# EAGLE design tick-mk-4.1 (EAGLE 6.5.0)
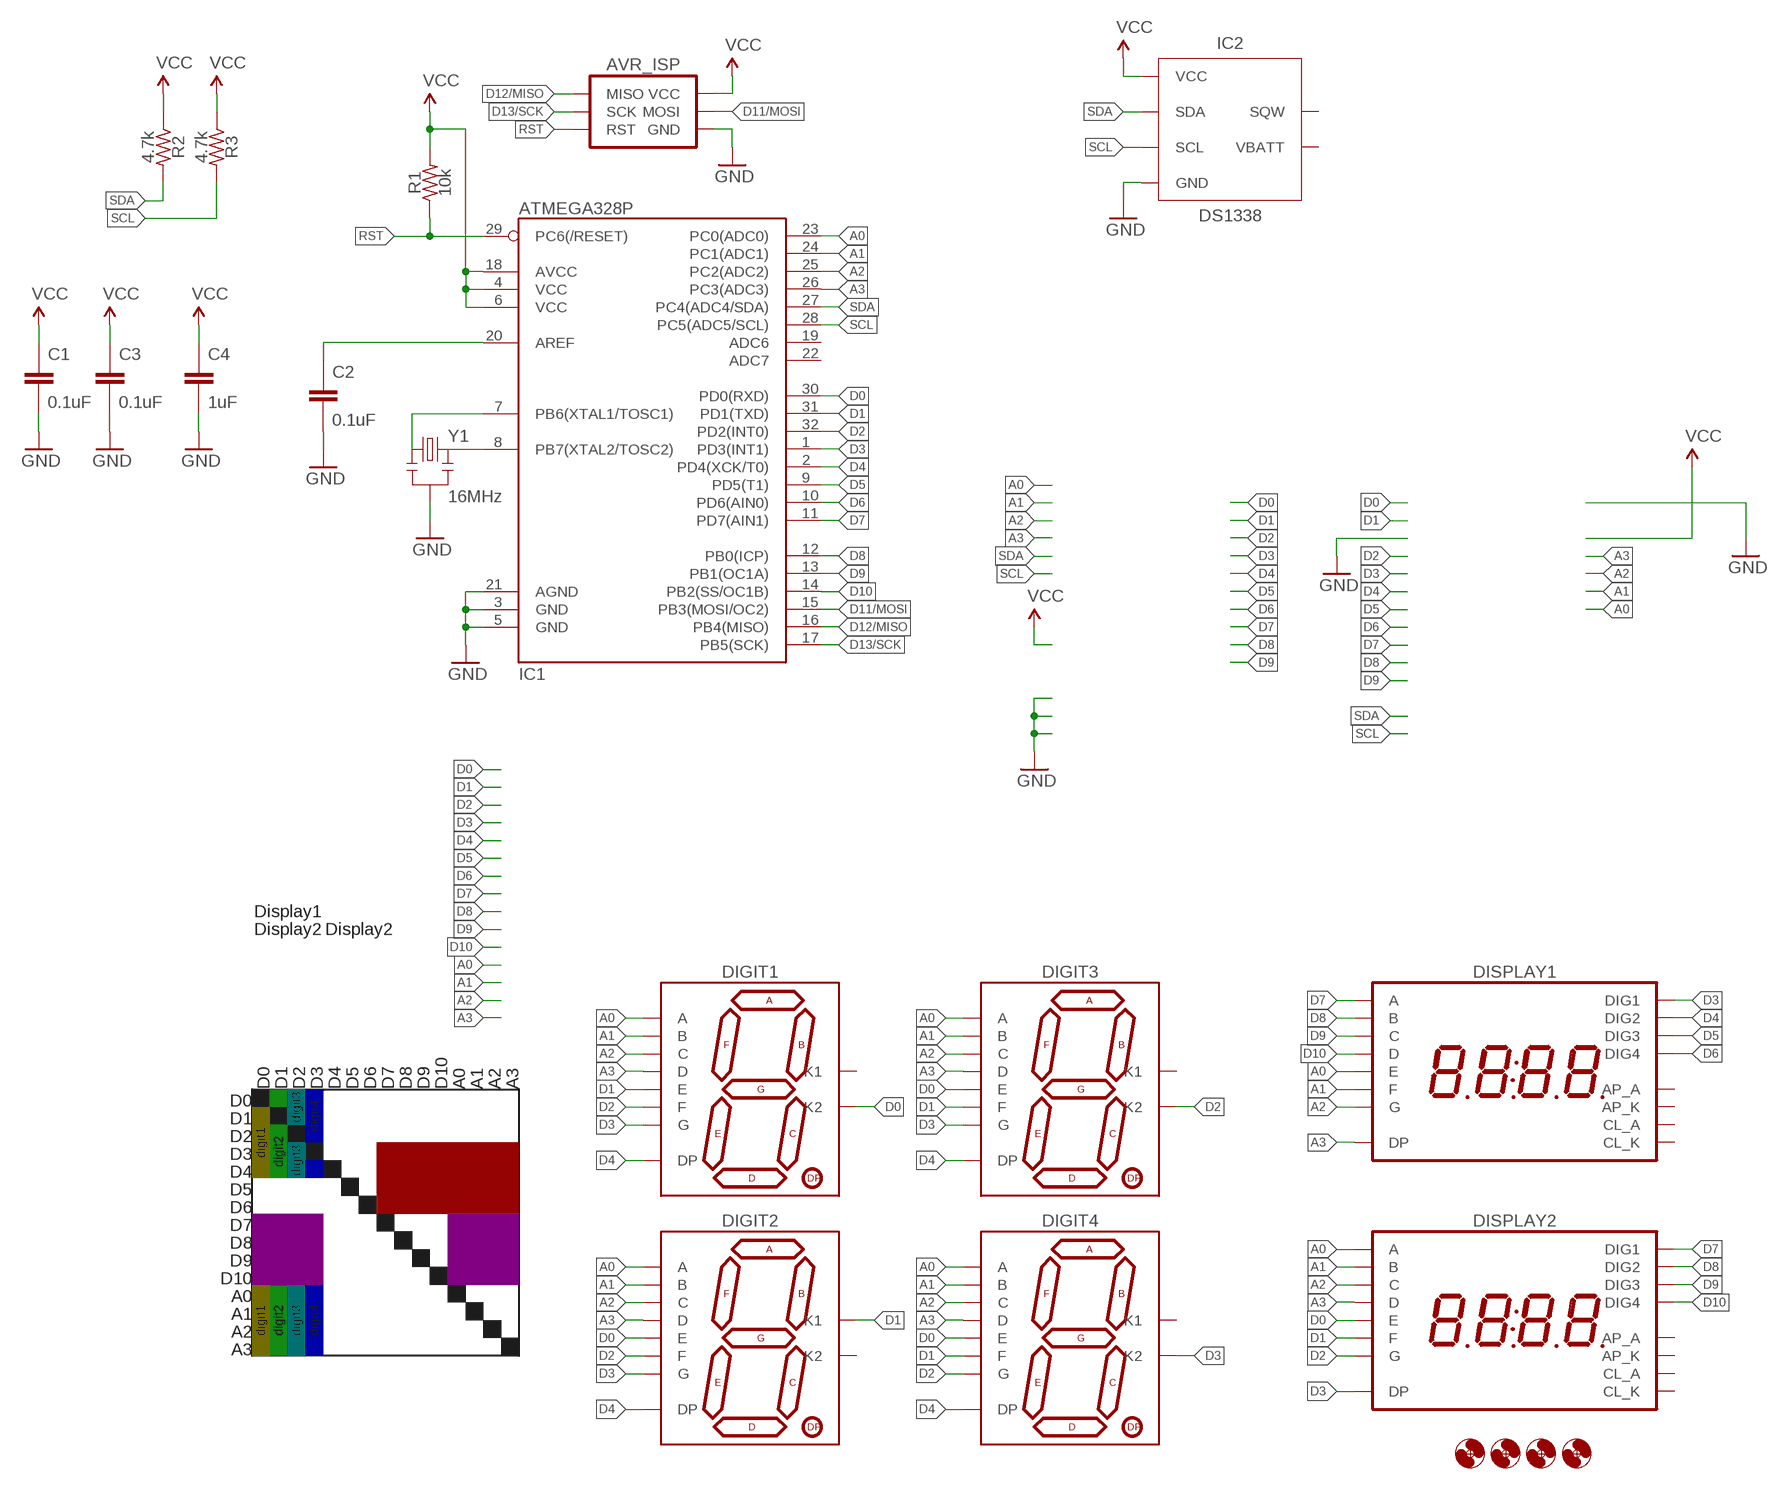
[diagram p0: schematic, sheet 1]

## Parts
AVR_ISP  AVR_SPI_PRG_6PTH  [2X3]
C1  0.1uF  CAPACITOR-CERAMICC0805  [C0805]
C2  0.1uF  CAPACITOR-CERAMICC0805  [C0805]
C3  0.1uF  CAPACITOR-CERAMICC0805  [C0805]
C4  1uF  CAPACITOR-CERAMICC0805  [C0805]
DIGIT1  7SEG_1DIGPTH-25.4MM  [7SEG_1DIG_25.4MM]
DIGIT2  7SEG_1DIGPTH-25.4MM  [7SEG_1DIG_25.4MM]
DIGIT3  7SEG_1DIGPTH-25.4MM  [7SEG_1DIG_25.4MM]
DIGIT4  7SEG_1DIGPTH-25.4MM  [7SEG_1DIG_25.4MM]
DISPLAY1  7SEG_4DIGIT_COLON_APOS  [7SEG_4DIG_10MM]
DISPLAY2  7SEG_4DIGIT_COLON_APOS  [7SEG_4DIG_10MM]
H1  HOLE#2  [HOLE-#2]
H2  HOLE#2  [HOLE-#2]
H3  HOLE#2  [HOLE-#2]
H4  HOLE#2  [HOLE-#2]
IC1  ATMEGA328P  ATMEGA328_SMT  [TQFP32-08]
IC2  DS1338  DS1338CSOIC16W  [SO16W]
R1  10k  RESISTORR0805  [R0805]
R2  4.7k  RESISTORR0805  [R0805]
R3  4.7k  RESISTORR0805  [R0805]
Y1  16MHz  RESONATORSMD-4.7X4.1X1.2  [RESONATOR-4.7X4.1X1.2MM]

## Nets
A0: DIGIT1.7(A) DIGIT2.7(A) DIGIT3.7(A) DIGIT4.7(A) DISPLAY1.5(E) DISPLAY2.14(A) IC1.23(PC0(ADC0))
A1: DIGIT1.6(B) DIGIT2.6(B) DIGIT3.6(B) DIGIT4.6(B) DISPLAY1.11(F) DISPLAY2.16(B) IC1.24(PC1(ADC1))
A2: DIGIT1.4(C) DIGIT2.4(C) DIGIT3.4(C) DIGIT4.4(C) DISPLAY1.15(G) DISPLAY2.13(C) IC1.25(PC2(ADC2))
A3: DIGIT1.2(D) DIGIT2.2(D) DIGIT3.2(D) DIGIT4.2(D) DISPLAY1.7(DP) DISPLAY2.3(D) IC1.26(PC3(ADC3))
D0: DIGIT1.8(K2) DIGIT2.1(E) DIGIT3.1(E) DIGIT4.1(E) DISPLAY2.5(E) IC1.30(PD0(RXD))
D1: DIGIT1.1(E) DIGIT2.3(K1) DIGIT3.9(F) DIGIT4.9(F) DISPLAY2.11(F) IC1.31(PD1(TXD))
D2: DIGIT1.9(F) DIGIT2.9(F) DIGIT3.8(K2) DIGIT4.10(G) DISPLAY2.15(G) IC1.32(PD2(INT0))
D3: DIGIT1.10(G) DIGIT2.10(G) DIGIT3.10(G) DIGIT4.8(K2) DISPLAY1.1(DIG1) DISPLAY2.7(DP) IC1.1(PD3(INT1))
D4: DIGIT1.5(DP) DIGIT2.5(DP) DIGIT3.5(DP) DIGIT4.5(DP) DISPLAY1.2(DIG2) IC1.2(PD4(XCK/T0))
D5: DISPLAY1.6(DIG3) IC1.9(PD5(T1))
D6: DISPLAY1.8(DIG4) IC1.10(PD6(AIN0))
D7: DISPLAY1.14(A) DISPLAY2.1(DIG1) IC1.11(PD7(AIN1))
D8: DISPLAY1.16(B) DISPLAY2.2(DIG2) IC1.12(PB0(ICP))
D9: DISPLAY1.13(C) DISPLAY2.6(DIG3) IC1.13(PB1(OC1A))
D10: DISPLAY1.3(D) DISPLAY2.8(DIG4) IC1.14(PB2(SS/OC1B))
D11/MOSI: AVR_ISP.4(MOSI) IC1.15(PB3(MOSI/OC2))
D12/MISO: AVR_ISP.1(MISO) IC1.16(PB4(MISO))
D13/SCK: AVR_ISP.3(SCK) IC1.17(PB5(SCK))
GND: AVR_ISP.6(GND) C1.2 C2.2 C3.2 C4.2 IC1.3(GND) IC1.5(GND) IC1.21(AGND) IC2.4(GND) IC2.5(GND) IC2.6(GND) IC2.7(GND) IC2.8(GND) IC2.9(GND) IC2.10(GND) IC2.11(GND) IC2.12(GND) IC2.13(GND) IC2.15(GND) Y1.2
N$1: C2.1 IC1.20(AREF)
N$2: IC1.7(PB6(XTAL1/TOSC1)) Y1.1
N$3: IC1.8(PB7(XTAL2/TOSC2)) Y1.3
RST: AVR_ISP.5(RST) IC1.29(PC6(/RESET)) R1.1
SCL: IC1.28(PC5(ADC5/SCL)) IC2.1(SCL) R3.2
SDA: IC1.27(PC4(ADC4/SDA)) IC2.16(SDA) R2.2
VCC: AVR_ISP.2(VCC) C1.1 C3.1 C4.1 IC1.4(VCC) IC1.6(VCC) IC1.18(AVCC) IC2.3(VCC) R1.2 R2.1 R3.1
Unconnected: DIGIT1.3(K1) DIGIT2.8(K2) DIGIT3.3(K1) DIGIT4.3(K1) DISPLAY1.4(CL_A) DISPLAY1.9(AP_K) DISPLAY1.10(AP_A) DISPLAY1.12(CL_K) DISPLAY2.4(CL_A) DISPLAY2.9(AP_K) DISPLAY2.10(AP_A) DISPLAY2.12(CL_K) IC1.19(ADC6) IC1.22(ADC7) IC2.2(SQW) IC2.14(VBATT)

## Notes on the sheet
- Display1
- Display2 | Display2
- D0 | D1 | D2 | D3 | D4 | D5 | D6 | D7 | D8 | D9 | D10 | A0 | A1 | A2 | A3
- D0 | digit3
- digit4
- D1
- D2 | digit1
- digit2
- D3 | digit3
- D4
- D5
- D6
- D7
- D8
- D9
- D10
- A0
- A1 | digit1 | digit2 | digit3 | digit4
- A2
- A3

## Library data of the parts
AVR_ISP = A_butts:AVR_SPI_PRG_6: AVR ISP 6 Pin This is the reduced ISP connector for AVR programming. Common on Arduino. This footprint will take up less PCB space and can be used with a 10-pin to 6-pin adapter such as SKU: BOB-08508 **Special note about "TEST_POINT" package. The stop mask is on the top side, so if you want your programming test points to be on the bottom of your board, make sure to place this package on the bottom side of the board. This also ensure that the orientation to program from the bottom side will be correct.
C1-C4 = A_butts:CAPACITOR-CERAMIC: CAPACITOR, European symbol
DIGIT1-DIGIT4 = A_butts:7SEG_1DIG
DISPLAY1 DISPLAY2 = A_butts:7SEG_4DIGIT_COLON_APOS
H1-H4 = A_butts:HOLE: MOUNTING HOLE with drill center marker
IC1 = A_butts:ATMEGA328_SMT: 32-Pin Atmega328 part Commonly used on Arduino compatible boards Available in QFP and QFN packages TQFP is IC-09069 QFN is non-stock; PROD_ID: IC-09069
IC2 = A_butts:DS1338C
R1-R3 = A_butts:RESISTOR: RESISTOR, American symbol
Y1 = A_butts:RESONATOR: Resonator Small SMD resonator. Used, eg, on the Arduino Pro/ Pro Mini boards. 8MHz- XTAL-08895 16MHz- XTAL-08900

## Board
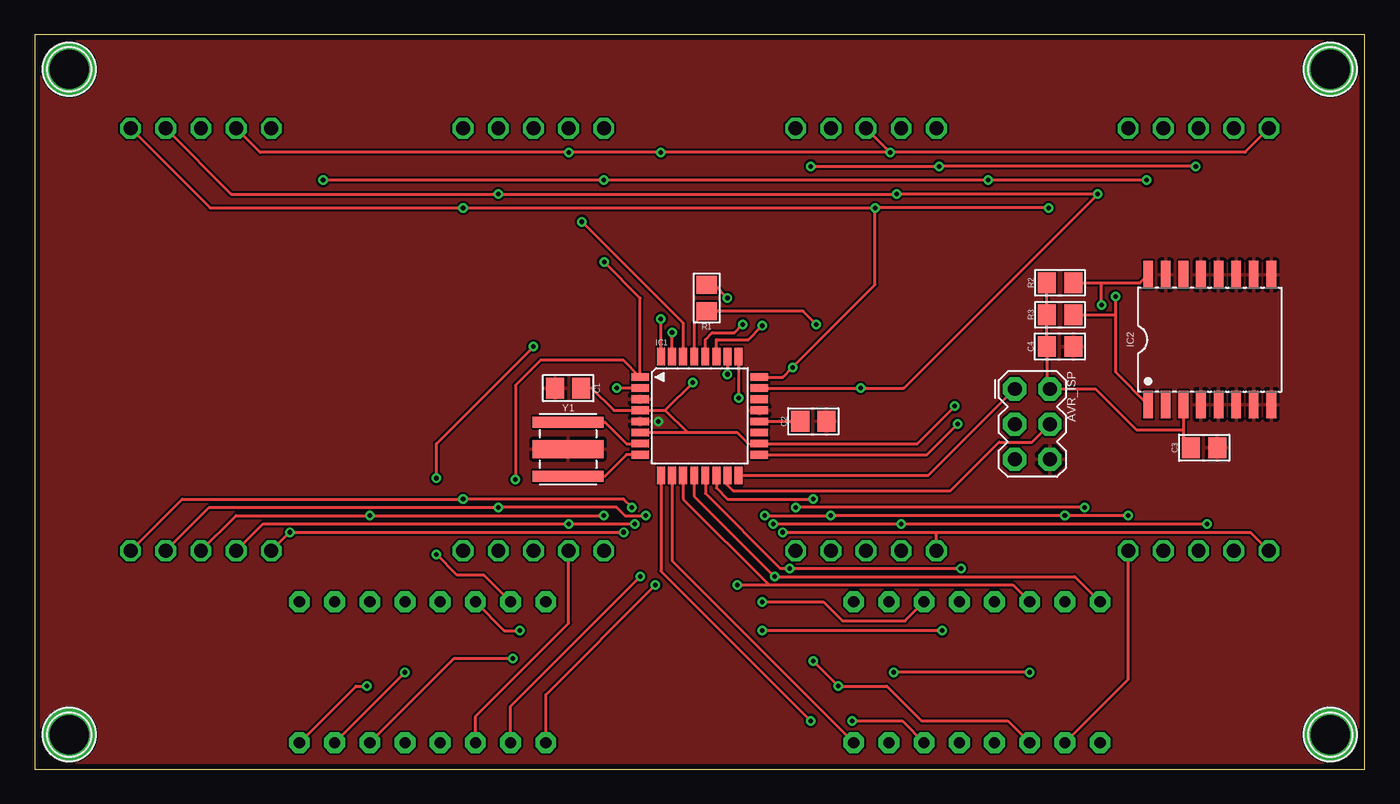
[diagram p1: board, top side]
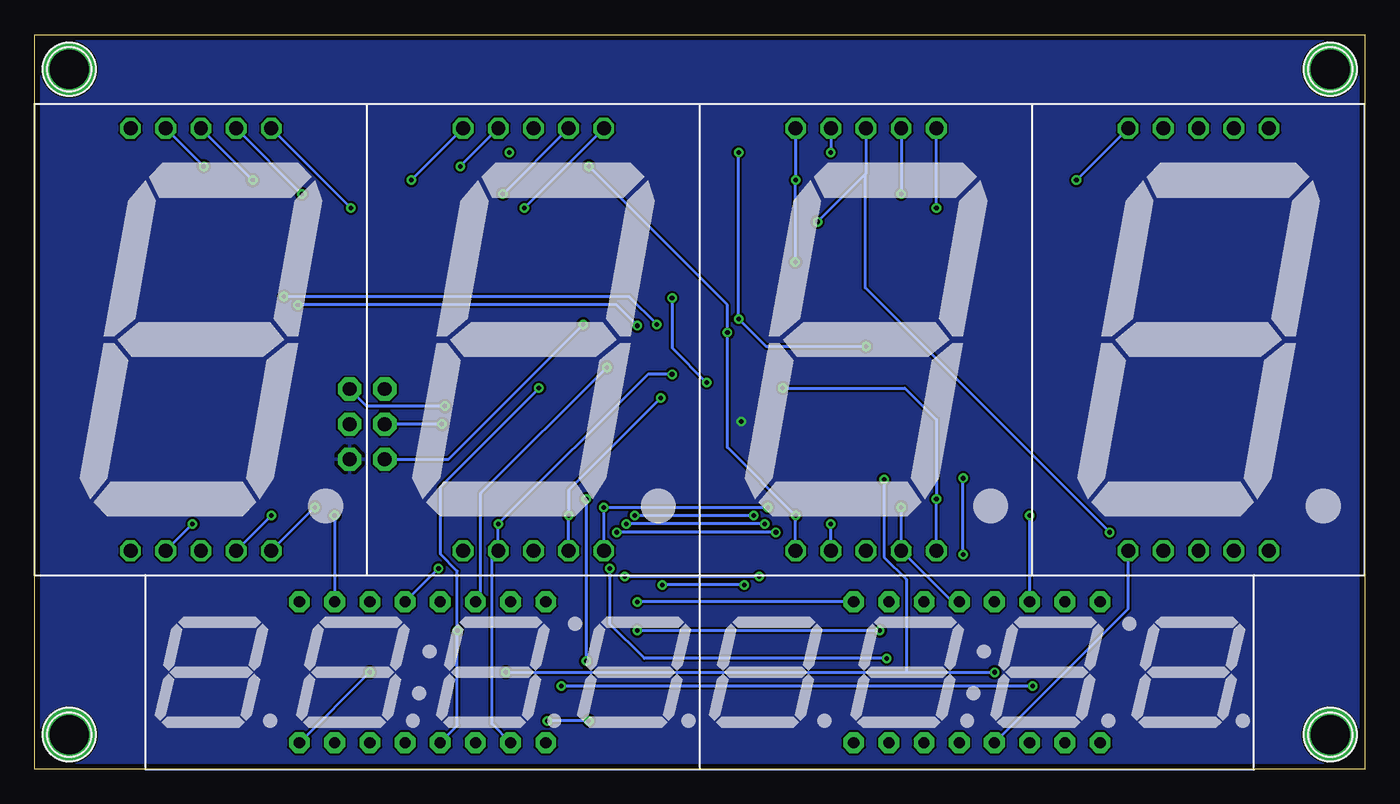
[diagram p2: board, bottom side, seen from below]

Size 96 x 53 mm. Coordinates in mm from the lower left corner, seen from the top.
Outline: 96,0 96,53 0,53 0,0 96,0
Copper layers (1*16): Top 0.0356mm / dielectric 1.5011mm / Bottom 0.0356mm
Design rules "LaenPCBOrder2": minimum track width 6mil, minimum drill 13mil, track to track 6mil, track to pad 6mil, pad to pad 6mil, via to via 6mil, smd to smd 6mil, copper to edge 15mil, drill to drill 6mil, minimum pad ring 7mil, minimum via ring 7mil, stop-mask expansion 3mil, vias tented up to drill 20mil, thermal gap 10mil

### Footprints (pad centres in the part's own frame; a part is rotated, then mirrored left to right if it is on the bottom)
2X3 = drill 1 pad 1.676 octagon: 1 -2.54,-1.27; 2 -2.54,1.27; 3 0,-1.27; 4 0,1.27; 5 2.54,-1.27; 6 2.54,1.27
C0805 = smd 1.3 x 1.5: 1 -0.95,0; 2 0.95,0
7SEG_1DIG_25.4MM = drill 1 pad 1.5 octagon: 1 -5.08,-15.24; 2 -2.54,-15.24; 3 0,-15.24; 4 2.54,-15.24; 5 5.08,-15.24; 6 5.08,15.24; 7 2.54,15.24; 8 0,15.24; 9 -2.54,15.24; 10 -5.08,15.24
7SEG_4DIG_10MM = drill 0.8 pad 1.5 octagon: 1 -8.89,-5.08; 2 -6.35,-5.08; 3 -3.81,-5.08; 4 -1.27,-5.08; 5 1.27,-5.08; 6 3.81,-5.08; 7 6.35,-5.08; 8 8.89,-5.08; 9 8.89,5.08; 10 6.35,5.08; 11 3.81,5.08; 12 1.27,5.08; 13 -1.27,5.08; 14 -3.81,5.08; 15 -6.35,5.08; 16 -8.89,5.08
HOLE-#2 = drill 2.8 pad 3.81: P$1 0,0
TQFP32-08 = smd 1.27 x 0.559: 1 -4.293,2.8; 2 -4.293,2; 3 -4.293,1.2; 4 -4.293,0.4; 5 -4.293,-0.4; 6 -4.293,-1.2; 7 -4.293,-2; 8 -4.293,-2.8; 17 4.293,-2.8; 18 4.293,-2; 19 4.293,-1.2; 20 4.293,-0.4; 21 4.293,0.4; 22 4.293,1.2; 23 4.293,2; 24 4.293,2.8 | smd 0.559 x 1.27: 9 -2.8,-4.293; 10 -2,-4.293; 11 -1.2,-4.293; 12 -0.4,-4.293; 13 0.4,-4.293; 14 1.2,-4.293; 15 2,-4.293; 16 2.8,-4.293; 25 2.8,4.293; 26 2,4.293; 27 1.2,4.293; 28 0.4,4.293; 29 -0.4,4.293; 30 -1.2,4.293; 31 -2,4.293; 32 -2.8,4.293
SO16W = smd 0.7 x 2: 1 -4.445,-4.685; 2 -3.175,-4.685; 3 -1.905,-4.685; 4 -0.635,-4.685; 5 0.635,-4.685; 6 1.905,-4.685; 7 3.175,-4.685; 8 4.445,-4.685; 9 4.445,4.685; 10 3.175,4.685; 11 1.905,4.685; 12 0.635,4.685; 13 -0.635,4.685; 14 -1.905,4.685; 15 -3.175,4.685; 16 -4.445,4.685
R0805 = smd 1.3 x 1.5: 1 -0.95,0; 2 0.95,0
RESONATOR-4.7X4.1X1.2MM = smd 0.8 x 5.1: 1 -1.95,0; 3 1.95,0 | smd 1.3 x 5.1: 2 0,0

### Placement (x,y rotation side)
AVR_ISP  72,24.9 270 top
C1  38.5,27.5 180 top
C2  56.2,25.1 0 top
C3  84.4,23.2 0 top
C4  74,30.5 0 top
DIGIT1  36,31 0 bottom
DIGIT2  12,31 0 bottom
DIGIT3  60,31 0 bottom
DIGIT4  84,31 0 bottom
DISPLAY1  68,7 0 bottom
DISPLAY2  28,7 0 bottom
H1  2.5,2.5 0 top
H2  2.5,50.5 0 top
H3  93.5,2.5 0 top
H4  93.5,50.5 0 top
IC1  48,25.5 0 top
IC2  84.8,31 0 top
R1  48.5,34 90 top
R2  74,35.1 0 top
R3  74,32.8 0 top
Y1  38.5,23.1 270 top

### Tracks (layer width: path | path; a pad name or v marks a point on that pad's centre or on a via)
A0  (via drill 0.33)
  Top 0.2: DIGIT2.7 14.2,41.5 v33.46,41.5 v62.2,41.5 v76.72,41.5 62.72,27.5 v59.6,27.5 IC1.23 | DISPLAY2.14 33.89,10 v35,10 | v65.5,10 v52.5,10
  Bottom 0.2: DIGIT4.7 v76.72,41.5 | v62.2,41.5 DIGIT3.7 | DIGIT1.7 v33.46,41.5 | DISPLAY1.5 65.5,3.15 v65.5,10 65.5,14.3 66.7,15.5 66.7,20.4 v59.6,27.5 | v35,10 v52.5,10
A1  (via drill 0.33)
  Top 0.2: IC1.24 54,28.3 v54.7,29 60.66,34.96 v60.66,40.5 | v73.18,40.5 v60.66,40.5 | DIGIT2.6 12.66,40.5 v30.92,40.5 v60.66,40.5 | v52.5,12.08 56.92,12.08 58.3,10.7 62.81,10.7 DISPLAY1.11
  Bottom 0.2: DIGIT4.6 v73.18,40.5 | v60.66,40.5 DIGIT3.6 | v30.92,40.5 DIGIT1.6 | DISPLAY1.11 63.8,12.47 63.8,19.9 v54.7,29 | DISPLAY2.16 v52.5,12.08
A2  (via drill 0.33)
  Top 0.2: DIGIT2.4 12.6,18.9 v33.46,18.9 42,18.9 42.6,18.3 v44.1,18.3 | v78.92,18.3 v74.35,18.3 v57.46,18.3 v52.7,18.3 | IC1.25 v50.8,26.8
  Bottom 0.2: v33.46,18.9 DIGIT1.4 29.78,12.08 DISPLAY2.13 | DIGIT4.4 v78.92,18.3 | DIGIT3.4 v57.46,18.3 57.46,20.14 v50.8,26.8 | v44.1,18.3 v52.7,18.3 | v74.35,18.3 DISPLAY1.15
A3  (via drill 0.33)
  Top 0.2: v43.3,17.7 v38.54,17.7 16.48,17.7 DIGIT2.2 | v53.3,17.7 v62.54,17.7 v84.6,17.7 | IC1.26 v50,28.5 | DISPLAY2.3 31.81,3.81 38.54,10.54 DIGIT1.2
  Bottom 0.2: v43.3,17.7 v53.3,17.7 | v84.6,17.7 DIGIT4.2 | DIGIT1.2 v38.54,17.7 | v50,28.5 51.74,28.5 v62.54,17.7 DIGIT3.2 63,15.3 63,3.27 DISPLAY1.7
D0  (via drill 0.33)
  Top 0.2: v39.5,39.5 46.8,32.2 IC1.30 | v42.5,17.1 v18.42,17.1 DIGIT2.1 | v54,17.1 65.08,17.1 | 65.08,17.1 87.74,17.1 DIGIT4.1 | DIGIT3.1 65.08,17.1
  Bottom 0.2: DIGIT1.8 36,43 36.05,42.95 | 36.05,42.95 v39.5,39.5 | v42.5,17.1 v54,17.1 | v18.42,17.1 36.05,34.73 36.05,42.95 | DISPLAY2.5 17.08,11.57 DIGIT2.1
D1  (via drill 0.33)
  Top 0.2: v83.8,43.5 v65.28,43.5 v56,43.5 | IC1.31 v46,31.5 | v41.08,18.3 v24.19,18.3 14.54,18.3 DIGIT2.3
  Bottom 0.2: DIGIT4.9 v83.8,43.5 | v65.28,43.5 DIGIT3.9 | v56,43.5 46,33.5 v46,31.5 46,23.22 v41.08,18.3 DIGIT1.1 | DISPLAY2.11 v24.19,18.3
D2  (via drill 0.33)
  Top 0.2: IC1.32 v45.2,32.5 | DIGIT2.9 16.28,44.5 v38.54,44.5 v45.2,44.5 v61.74,44.5 | DIGIT4.10 87.34,44.5 v61.74,44.5 | v61.74,44.5 DIGIT3.8 | DISPLAY2.15 32.43,14 30.5,14 v29,15.5 | v29,21 29,23.5 v36,30.5
  Bottom 0.2: DIGIT1.9 v38.54,44.5 | v45.2,44.5 v45.2,32.5 43.2,30.5 v36,30.5 | v29,15.5 v29,21
D3  (via drill 0.33)
  Top 0.2: v80.26,42.5 v68.82,42.5 v41.08,42.5 v20.82,42.5 | v41.1,36.6 43.71,33.99 IC1.1 42.51,29.5 36.5,29.5 34.7,27.7 v34.7,20.9 | v71.81,7 v62,7 | v26.73,7 DISPLAY2.7
  Bottom 0.2: DIGIT2.10 v20.82,42.5 | DIGIT4.8 v80.26,42.5 | v68.82,42.5 DIGIT3.10 | DIGIT1.10 v41.08,42.5 41.1,42.48 v41.1,36.6 | DISPLAY1.1 v71.81,7 | v62,7 33.1,7 | 33.1,7 v26.73,7 | v34.7,20.9 34.7,15.3 33.1,13.7 33.1,7
D4  (via drill 0.33)
  Top 0.2: DIGIT2.5 10.66,19.5 v30.92,19.5 42.5,19.5 v43.1,18.9 | v75.78,18.9 v54.92,18.9 | IC1.2 v42,27.5 | DISPLAY1.2 78.92,6.49 DIGIT4.5
  Bottom 0.2: DIGIT1.5 v30.92,19.5 30.92,25.22 33.2,27.5 v42,27.5 | DIGIT4.5 v75.78,18.9 | v43.1,18.9 v54.92,18.9 DIGIT3.5
D5  (via drill 0.33)
  Top 0.2: IC1.9 45.2,14.3 v56,3.5 | v59,3.5 62.61,3.5 DISPLAY1.6
  Bottom 0.2: v56,3.5 v59,3.5
D6
  Top 0.2: IC1.10 46,15.03 DISPLAY1.8
D7  (via drill 0.33)
  Top 0.2: IC1.11 46.8,19.5 53,13.3 | 53,13.3 70.59,13.3 DISPLAY1.14 | DISPLAY2.1 36.89,5.39 v44.8,13.3 | v50.7,13.3 53,13.3
  Bottom 0.2: v44.8,13.3 v50.7,13.3
D8  (via drill 0.33)
  Top 0.2: IC1.12 47.6,19.7 v53.4,13.9 75.07,13.9 DISPLAY1.16 | DISPLAY2.2 34.35,4.55 v43.7,13.9
  Bottom 0.2: v43.7,13.9 v53.4,13.9
D9  (via drill 0.33)
  Top 0.2: IC1.13 48.4,19.9 53.8,14.5 v54.5,14.5 v66.85,14.5 | DISPLAY2.6 30.27,8 v34.5,8
  Bottom 0.2: v66.85,14.5 DISPLAY1.13 | v34.5,8 52,8 54.5,10.5 v54.5,14.5
D10  (via drill 0.33)
  Top 0.2: IC1.14 49.2,20.3 50,19.5 v56.2,19.5 | DISPLAY1.3 70.23,3.5 64,3.5 61.5,6 v58,6 v56.2,7.8 | DISPLAY2.8 23.19,6 v23.99,6
  Bottom 0.2: v23.99,6 v58,6 | v56.2,19.5 v56.2,7.8
D11/MOSI
  Top 0.2: IC1.15 50,20.5 50.4,20.1 66.1,20.1 69.6,23.6 71.97,23.6 AVR_ISP.4
D12/MISO
  Top 0.2: IC1.16 64.5,21.21 AVR_ISP.1
D13/SCK  (via drill 0.33)
  Top 0.2: IC1.17 64.4,22.7 v66.6,24.9
  Bottom 0.2: v66.6,24.9 AVR_ISP.3
GND  (via drill 0.33)
  other vias: 45,25.1
  pour Bottom: 0,53 96,53 96,0 0,0
  pour Top: 0,0 0,53 96,53 96,0
N$1
  Top 0.2: IC1.20 C2.1
N$2
  Top 0.2: IC1.7 42.7,23.5 41.15,25.05 Y1.1
N$3
  Top 0.2: IC1.8 42.7,22.7 41.15,21.15 Y1.3
RST  (via drill 0.33)
  Top 0.2: IC1.29 47.6,32.15 R1.1 55.45,33.05 v56.4,32.1
  Bottom 0.2: AVR_ISP.5 66.14,22.36 v56.4,32.1
SCL  (via drill 0.33)
  Top 0.2: IC1.28 48.4,31 48.9,31.5 50.5,31.5 v51.1,32.1 | v78,34.1 78,32.8 | 78,32.8 78,28.67 IC2.1 | R3.2 78,32.8
  Bottom 0.2: v51.1,32.1 53.1,34.1 v78,34.1
SDA  (via drill 0.33)
  Top 0.2: IC1.27 49.2,31 51.5,31 v52.5,32 | v77,33.5 77,35.1 | 77,35.1 79.77,35.1 IC2.16 | R2.2 77,35.1
  Bottom 0.2: v52.5,32 54,33.5 v77,33.5
VCC  (via drill 0.33)
  Top 0.152: 51.5,23.5 IC1.18 | 40.2,27.5 C1.1
  Top 0.2: IC1.6 47.1,24.3 | 47.1,24.3 50.7,24.3 51.5,23.5 | 45.5,25.9 IC1.4 41.8,25.9 40.2,27.5 | 45.5,25.9 47.1,24.3 | R1.2 49.05,34.95 v50,34 | v47.5,27.9 45.5,25.9 | IC1.18 63.7,23.5 v66.4,26.2 | R2.1 R3.1 C4.1 73.05,27.66 AVR_ISP.2 76.56,27.44 79.5,24.5 82.89,24.5 | IC2.3 82.89,24.5 | 82.89,24.5 82.89,23.75 C3.1
  Bottom 0.2: v50,34 50,30.4 v47.5,27.9 | v66.4,26.2 72.03,26.2 AVR_ISP.2